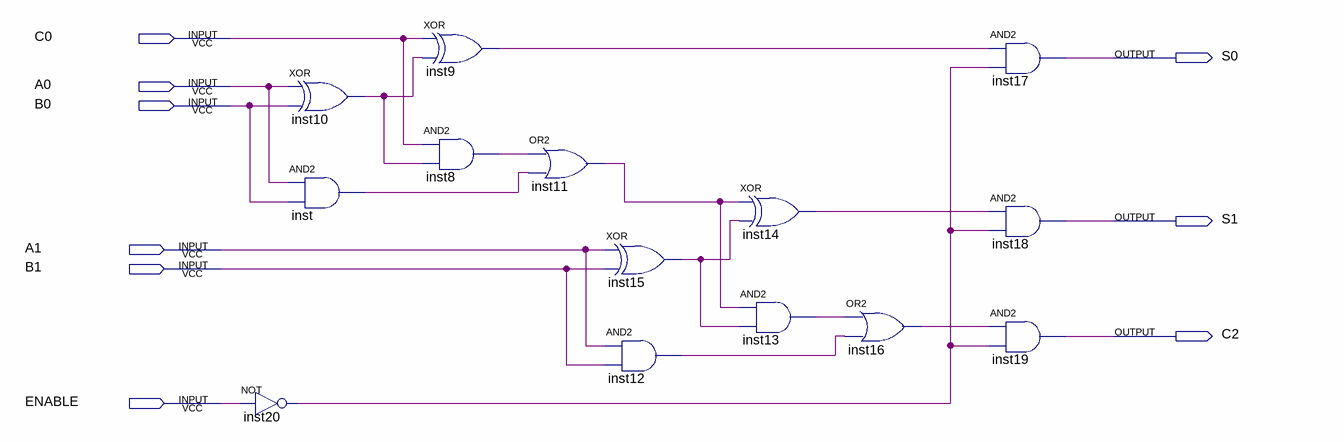
[diagram p0: schematic sheet]
// Quartus schematic lab1.bdf as structural Verilog: 14 symbols, 9 pins
module lab1 (
  input  C0,
  input  A0,
  input  B0,
  input  A1,
  input  B1,
  input  ENABLE,
  output S0,
  output S1,
  output C2
);

  wire inst8_out, inst9_out, inst10_out, inst11_out, inst12_out, inst13_out, inst14_out, inst15_out,
       inst16_out, inst20_out, inst_out;

  not inst20 (inst20_out, ENABLE);
  xor inst10 (inst10_out, A0, B0);
  and inst (inst_out, A0, B0);
  xor inst9 (inst9_out, C0, inst10_out);
  and inst8 (inst8_out, C0, inst10_out);
  or inst11 (inst11_out, inst8_out, inst_out);
  xor inst15 (inst15_out, A1, B1);
  and inst12 (inst12_out, A1, B1);
  xor inst14 (inst14_out, inst11_out, inst15_out);
  and inst13 (inst13_out, inst11_out, inst15_out);
  or inst16 (inst16_out, inst13_out, inst12_out);
  and inst17 (S0, inst9_out, inst20_out);
  and inst18 (S1, inst14_out, inst20_out);
  and inst19 (C2, inst16_out, inst20_out);
endmodule
